# Altium schematic sheet Sheet6.SchDoc
size A4
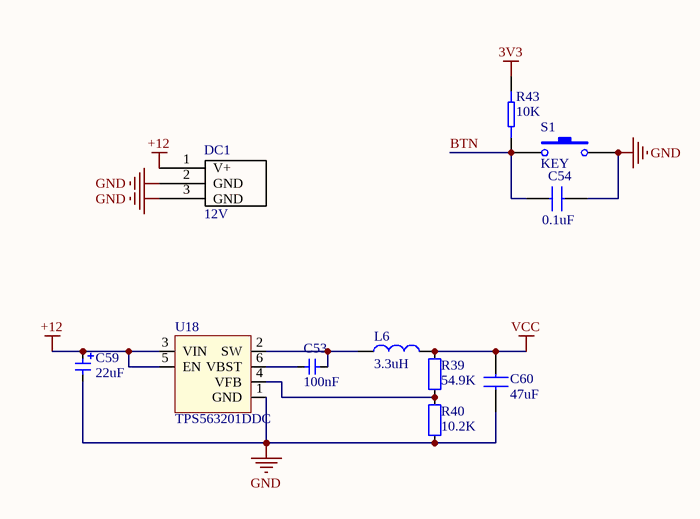
[diagram p0: Sheet6.SchDoc]

## Parts
C53  100nF  [CAP_0805]
C54  0.1uF  [0402C]
C59  22uF  [CAP_TAN_B1210]
C60  47uF  [1206C]
DC1  12V  [DC005-2.0MM]
L6  3.3uH  [SLF10145]
R39  54.9K  [RES_0402]
R40  10.2K  [RES_0402]
R43  10K  [0402R]
S1  KEY  [SKHHLVA010]
U18  TPS563201DDC  [SOT23-6]

## Nets
3V3: R43.2
+12: C59.1 DC1.1(V+) U18.3(VIN) U18.5(EN)
GND: C54.2 C59.2 C60.2 DC1.2(GND) DC1.3(GND) R40.1 S1.2 U18.1(GND)
VCC: C60.1 L6.1 R39.2
BTN: C54.1 R43.1 S1.1
NetC53_1: C53.1 U18.6(VBST)
NetC53_2: C53.2 L6.2 U18.2(SW)
NetR39_1: R39.1 R40.2 U18.4(VFB)

## Library data of the parts
C53 = Cap_0805: Capacitor; Value: 100nF
C54 C60 = CAP: SMD-CAP
C59 = Cap_Tan_1210: Capacitor; Value: 22uF
DC1 = DC5V
L6 = L1: SLF10145T-3R3N3R7-PF
R39 R40 = Res_0402: Resistor
  R39: Value: 54.9K
  R40: Value: 10.2K
R43 = R
S1 = SW-PB: SKHHLVA010; Published: 24-Mar-1999; LatestRevisionDate: 17-Jul-2002; LatestRevisionNote: Re-released for DXP Platform.; PackageReference: SPST-2; Publisher: Altium Limited